# EAGLE design power (EAGLE 7.7.0)
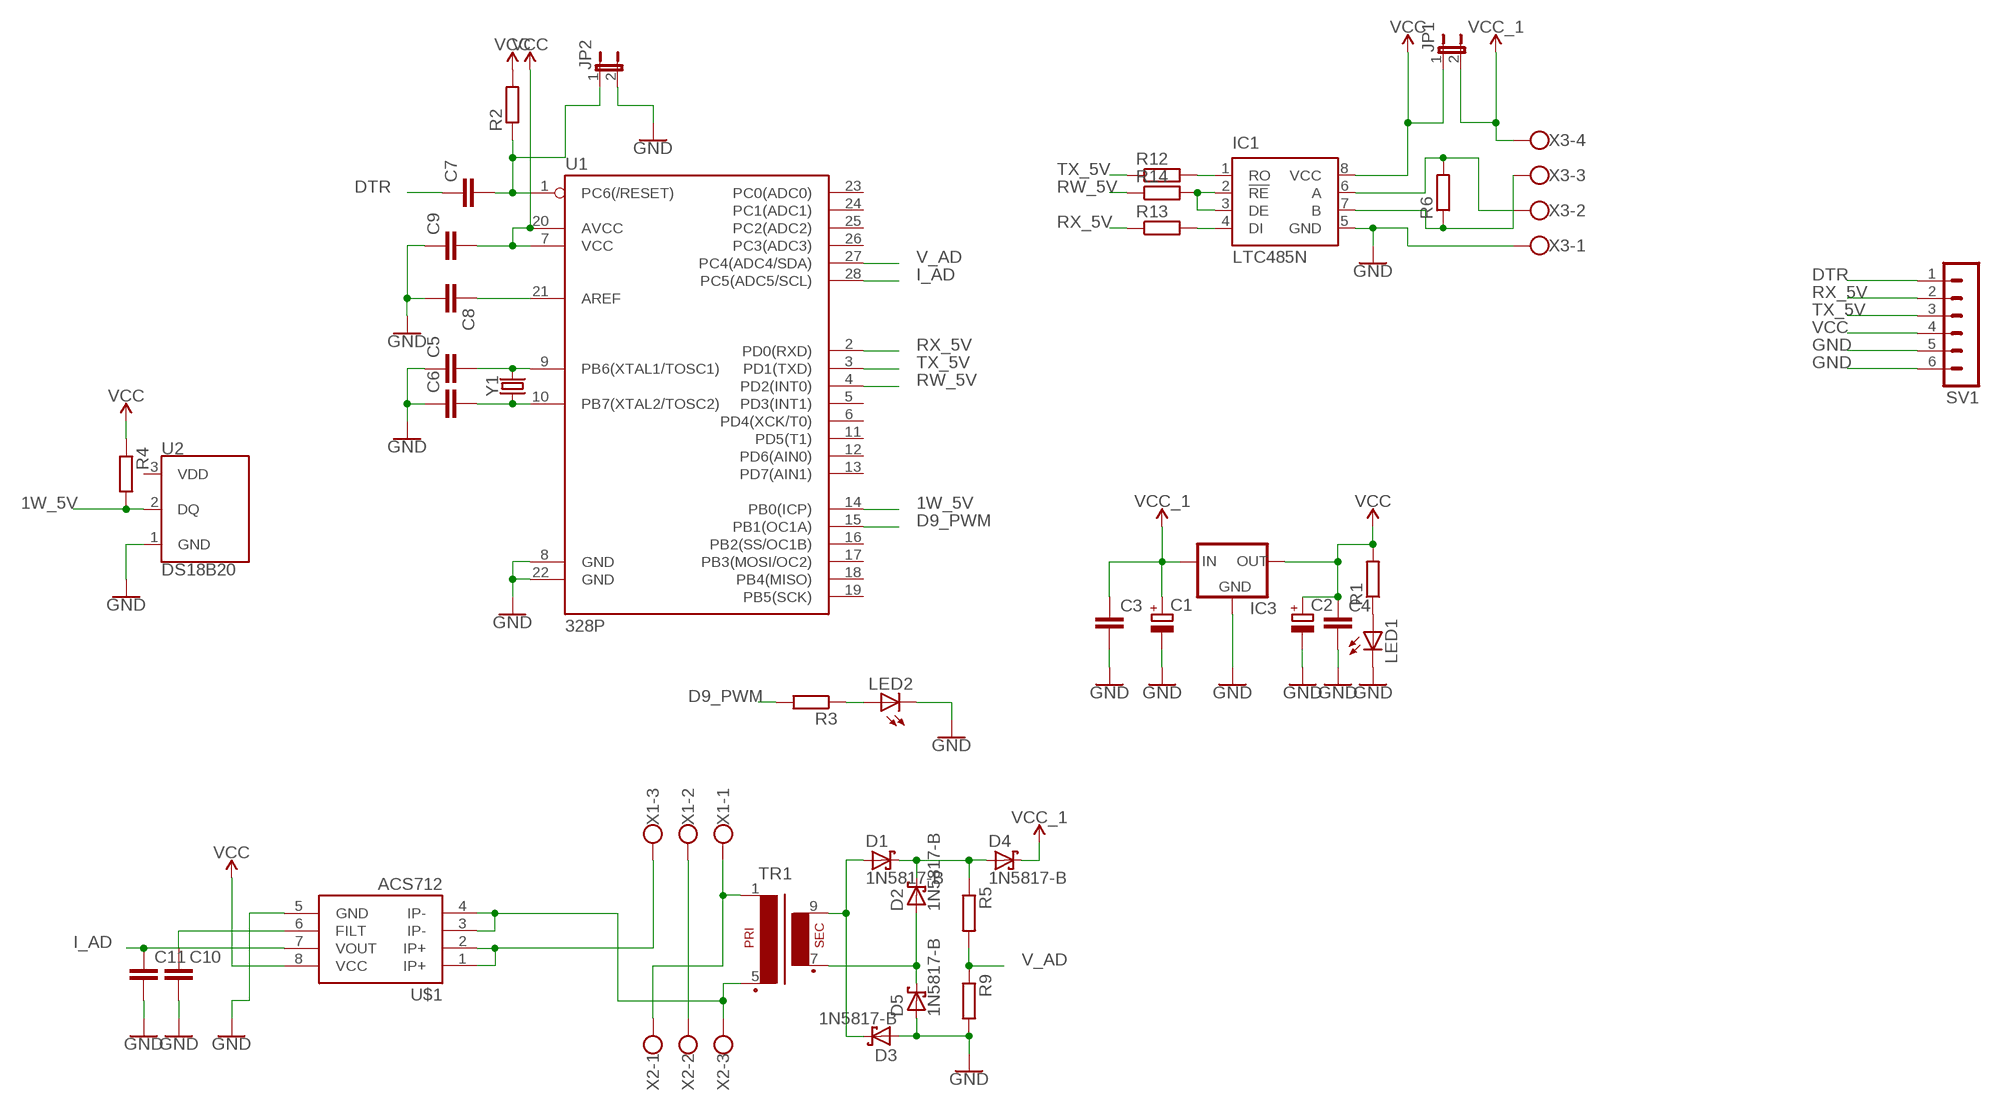
[diagram p0: schematic, sheet 1]

## Parts
C1  CPOL-EUE5-10.5  [E5-10,5]
C2  CPOL-EUE5-10.5  [E5-10,5]
C3  C-EU025-025X050  [C025-025X050]
C4  C-EU025-025X050  [C025-025X050]
C5  C-EU025-025X050  [C025-025X050]
C6  C-EU025-025X050  [C025-025X050]
C7  C-EU025-025X050  [C025-025X050]
C8  C-EU025-025X050  [C025-025X050]
C9  C-EU025-025X050  [C025-025X050]
C10  C-EU025-025X050  [C025-025X050]
C11  C-EU025-025X050  [C025-025X050]
D1  1N5817-B  [DO41-7.6]
D2  1N5817-B  [DO41-7.6]
D3  1N5817-B  [DO41-7.6]
D4  1N5817-B  [DO41-7.6]
D5  1N5817-B  [DO41-7.6]
IC1  LTC485N  [DIL08]
IC3  78XXL  [78XXL]
JP1  JP1E  [JP1]
JP2  JP1E  [JP1]
LED1  LED5MM  [LED5MM]
LED2  LED5MM  [LED5MM]
R1  R-EU_0204/7  [0204/7]
R2  R-EU_0204/7  [0204/7]
R3  R-EU_0204/7  [0204/7]
R4  R-EU_0204/7  [0204/7]
R5  R-EU_0204/7  [0204/7]
R6  R-EU_0204/7  [0204/7]
R9  R-EU_0204/7  [0204/7]
R12  R-EU_0204/7  [0204/7]
R13  R-EU_0204/7  [0204/7]
R14  R-EU_0204/7  [0204/7]
SV1  MA06-1  [MA06-1]
TR1  EI30-1  [EI30-1]
U1  328P  ATMEGA328P_PDIP  [DIP28]
U2  DS18B20  [TO-92-AMMO]
U$1  ACS712  [SO08]
X1  W237-103  [W237-103]
X2  W237-103  [W237-103]
X3  W237-4  [W237-4]
Y1  CRYSTALPTH-HC49US  [HC49US]

## Nets
1W_5V: R4.2 U1.14(PB0(ICP)) U2.2(DQ)
D9_PWM: R3.2 U1.15(PB1(OC1A))
DTR: C7.1 SV1.1
GND: C1.- C2.- C3.2 C4.2 C5.1 C6.1 C8.2 C9.1 C10.2 C11.2 D3.A D5.A IC1.5(GND) IC3.GND JP2.2 LED1.K(C) LED2.K(C) R9.2 SV1.5 SV1.6 U1.8(GND) U1.22(GND) U2.1(GND) U$1.5(GND) X3.1
I_AD: C11.1 U1.28(PC5(ADC5/SCL)) U$1.7(VOUT)
N$1: LED1.A R1.1
N$2: C5.2 U1.9(PB6(XTAL1/TOSC1)) Y1.2
N$3: C6.2 U1.10(PB7(XTAL2/TOSC2)) Y1.1
N$4: IC1.4(DI) R13.2
N$5: IC1.7(B) R6.1 X3.3
N$6: C8.1 U1.21(AREF)
N$7: LED2.A R3.1
N$8: IC1.1(RO) R12.2
N$9: D1.A D3.C TR1.9(S4)
N$10: C7.2 JP2.1 R2.1 U1.1(PC6(/RESET))
N$11: IC1.6(A) R6.2 X3.2
N$12: X1.2 X2.2
N$13: IC1.2(!RE) IC1.3(DE) R14.2
N$14: TR1.1 X1.1 X2.1
N$16: D2.A D5.C TR1.7(S3)
N$17: U$1.1(IP+) U$1.2(IP+) X1.3
N$19: C10.1 U$1.6(FILT)
N$20: TR1.5(P2) U$1.3(IP-) U$1.4(IP-) X2.3
N$26: D1.C D2.C D4.A R5.1
RW_5V: R14.1 U1.4(PD2(INT0))
RX_5V: R13.1 SV1.2 U1.2(PD0(RXD))
TX_5V: R12.1 SV1.3 U1.3(PD1(TXD))
V_AD: R5.2 R9.1 U1.27(PC4(ADC4/SDA))
VCC: C2.+ C4.1 C9.2 IC1.8(VCC) IC3.OUT JP1.1 R1.2 R2.2 R4.1 SV1.4 U1.7(VCC) U1.20(AVCC) U$1.8(VCC)
VCC_1: C1.+ C3.1 D4.C IC3.IN JP1.2 X3.4
Unconnected: U1.5(PD3(INT1)) U1.6(PD4(XCK/T0)) U1.11(PD5(T1)) U1.12(PD6(AIN0)) U1.13(PD7(AIN1)) U1.16(PB2(SS/OC1B)) U1.17(PB3(MOSI/OC2)) U1.18(PB4(MISO)) U1.19(PB5(SCK)) U1.23(PC0(ADC0)) U1.24(PC1(ADC1)) U1.25(PC2(ADC2)) U1.26(PC3(ADC3))

## Power pins joined to a net without a drawn wire
VDD: U2.3(VDD)

## Library data of the parts
C1 C2 = rcl:CPOL-EU: POLARIZED CAPACITOR, European symbol
C3-C11 = rcl:C-EU: CAPACITOR, European symbol
D1-D5 = diode:1N581*: 1.0A SCHOTTKY BARRIER RECTIFIER Source: http://www.diodes.com/datasheets/ds23001.pdf
IC1 = linear-technology:LTC485: Low Power RS485 Interface Transceiver Source: http://www.linear.com/pc/downloadDocument.do?navId=H0,C1,C1007,C1017,P2064,D1718; OC_FARNELL: unknown; OC_NEWARK: unknown
IC3 = v-reg:78XXL: VOLTAGE REGULATOR
JP1 JP2 = jumper:JP1E: JUMPER
LED1 LED2 = led:LED: LED OSRAM: - CHIPLED LG R971, LG N971, LY N971, LG Q971, LY Q971, LO R971, LY R971 LH N974, LH R974 LS Q976, LO Q976, LY Q976 LO Q996 - Hyper CHIPLED LW Q18S LB Q993, LB Q99A, LB R99A - SideLED LS A670, LO A670, LY A670, LG A670, LP A670 LB A673, LV A673, LT A673, LW A673 LH A674 LY A675 LS A676, LA A676, LO A676, LY A676, LW A676 LS A679, LY A679, LG A679 - Hyper Micro SIDELED® LS Y876, LA Y876, LO Y876, LY Y876 LT Y87S - SmartLED LW L88C, LW L88S LB L89C, LB L89S, LG L890 LS L89K, LO L89K, LY L89K LS L896, LA L896, LO L896, LY L896 - TOPLED LS T670, LO T670, LY T670, LG T670, LP T670 LSG T670, LSP T670, LSY T670, LOP T670, LYG T670 LG T671, LOG T671, LSG T671 LB T673, LV T673, LT T673, LW T673 LH T674 LS T676, LA T676, LO T676, LY T676, LB T676, LH T676, LSB T676, LW T676 LB T67C, LV T67C, LT T67C, LS T67K, LO T67K, LY T67K, LW E67C LS E67B, LA E67B, LO E67B, LY E67B, LB E67C, LV E67C, LT E67C LW T67C LS T679, LY T679, LG T679 LS T770, LO T770, LY T770, LG T770, LP T770 LB T773, LV T773, LT T773, LW T773 LH T774 LS E675, LA E675, LY E675, LS T675 LS T776, LA T776, LO T776, LY T776, LB T776 LHGB T686 LT T68C, LB T68C - Hyper Mini TOPLED® LB M676 - Mini TOPLED Santana® LG M470 LS M47K, LO M47K, LY M47K Source: http://www.osram.convergy.de LUXEON: - LUMILED® LXK2-PW12-R00, LXK2-PW12-S00, LXK2-PW14-U00, LXK2-PW14-V00 LXK2-PM12-R00, LXK2-PM12-S00, LXK2-PM14-U00 LXK2-PE12-Q00, LXK2-PE12-R00, LXK2-PE12-S00, LXK2-PE14-T00, LXK2-PE14-U00 LXK2-PB12-K00, LXK2-PB12-L00, LXK2-PB12-M00, LXK2-PB14-N00, LXK2-PB14-P00, LXK2-PB14-Q00 LXK2-PR12-L00, LXK2-PR12-M00, LXK2-PR14-Q00, LXK2-PR14-R00 LXK2-PD12-Q00, LXK2-PD12-R00, LXK2-PD12-S00 LXK2-PH12-R00, LXK2-PH12-S00 LXK2-PL12-P00, LXK2-PL12-Q00, LXK2-PL12-R00 Source: www.luxeon.com KINGBRIGHT: KA-3528ASYC Source: www.kingbright.com
R1-R6 R9 R12-R14 = rcl:R-EU_: RESISTOR, European symbol
SV1 = con-lstb:MA06-1: PIN HEADER; OC_FARNELL: unknown; OC_NEWARK: unknown
TR1 = trafo:EI30-1: TRANSFORMER 1 primary winding, 1 secondary winding ERA
U1 = SparkFun-IC-Microcontroller:ATMEGA328P_PDIP: Atmel 328P Through hole ATMEGA328P uC used in the Arduino 32kb flash, 1k EEPROM, 2k SRAM Datasheet <http://www.sparkfun.com/datasheets/Components/SMD/ATMega328.pdf> SparkFun Products Storefront component: AVR 28 Pin 20MHz 32K 6A/D - ATMega328P <https://www.sparkfun.com/products/9061> (COM-09061) SparkFun Simon Says - Through-Hole Soldering Kit <https://www.sparkfun.com/products/10547> (KIT-10547) SparkFun Learn to Solder - Simon Says <https://www.sparkfun.com/products/13708> (KIT-13708) SparkFun BigTime Watch Kit <https://www.sparkfun.com/products/11734> (KIT-11734) SparkFun ClockIt <https://www.sparkfun.com/products/10930> (KIT-10930) SparkFun Serial Enabled LCD Kit <https://www.sparkfun.com/products/10097> (LCD-10097) SparkFun Simon Tilts - Through Hole Soldering Kit <https://www.sparkfun.com/products/12634> (KIT-12634) SparkFun Frequency Counter Kit <https://www.sparkfun.com/products/10140> (KIT-10140) FabFM Radio Kit <https://www.sparkfun.com/products/11043> (KIT-11043) SparkFun Binary Blaster Kit <https://www.sparkfun.com/products/12037> (KIT-12037) SparkFun Metro-Gnome <https://www.sparkfun.com/products/9236> (KIT-09236) ATmega328 with Arduino Optiboot (Uno) <https://www.sparkfun.com/products/10524> (DEV-10524); PROD_ID: IC-09136
U2 = SparkFun-Sensors:DS18B20: Dallas/Maxim DS18B20 1-Wire Temperature Sensor The DS18B20 reports degrees C with 9 to 12-bit precision, -55C to 125C (+/-0.5C). Each sensor has a unique 64-Bit Serial number etched into it - allows for a huge number of sensors to be used on one data bus. Datasheet <http://datasheets.maximintegrated.com/en/ds/DS18B20.pdf> SparkFun Products One Wire Digital Temperature Sensor - DS18B20 <https://www.sparkfun.com/products/245> (SEN-00245); STORE_ID: SEN-00245
U$1 = SparkFun-Sensors:ACS712: ACS712 Hall-effect-based isolated linear current sensor Datasheet <http://www.sparkfun.com/datasheets/BreakoutBoards/0712.pdf> SparkFun Products SparkFun Low Current Sensor Breakout - ACS712 <https://www.sparkfun.com/products/8883> (SEN-08883); PROD_ID: IC-08964
X1 X2 = con-wago-500:W237-103: WAGO SCREW CLAMP; MPN: 237-103; OC_FARNELL: unknown; OC_NEWARK: 18M7116
X3 = con-wago-500:W237-4: WAGO SCREW CLAMP; OC_FARNELL: unknown; OC_NEWARK: unknown
Y1 = SparkFun-Clocks:CRYSTAL: Crystals (Generic) These are passive quartz crystals, which can be used as a clock source for a microcontroller. Crystal's are two-terminal devices. They require external "load" capacitors to generate an oscillating signal.

## Board
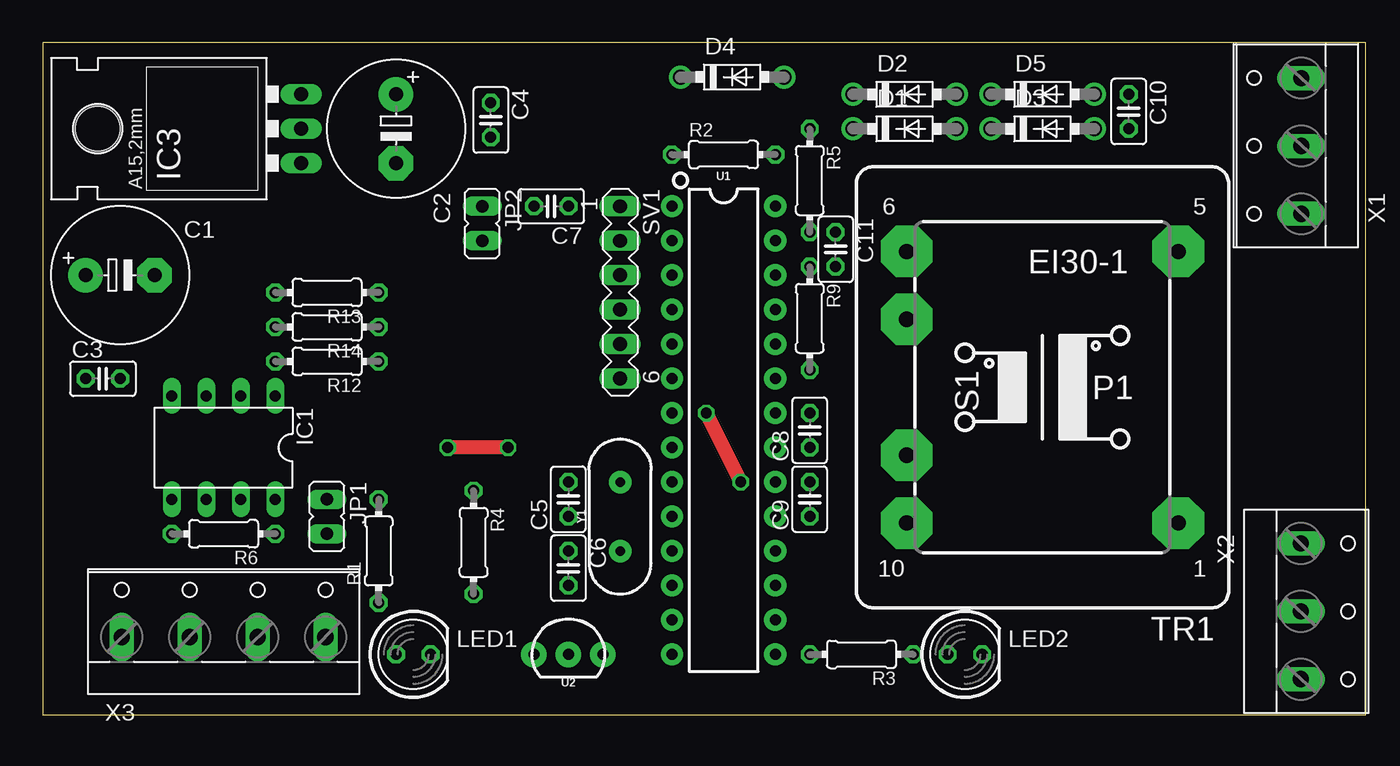
[diagram p1: board, top side]
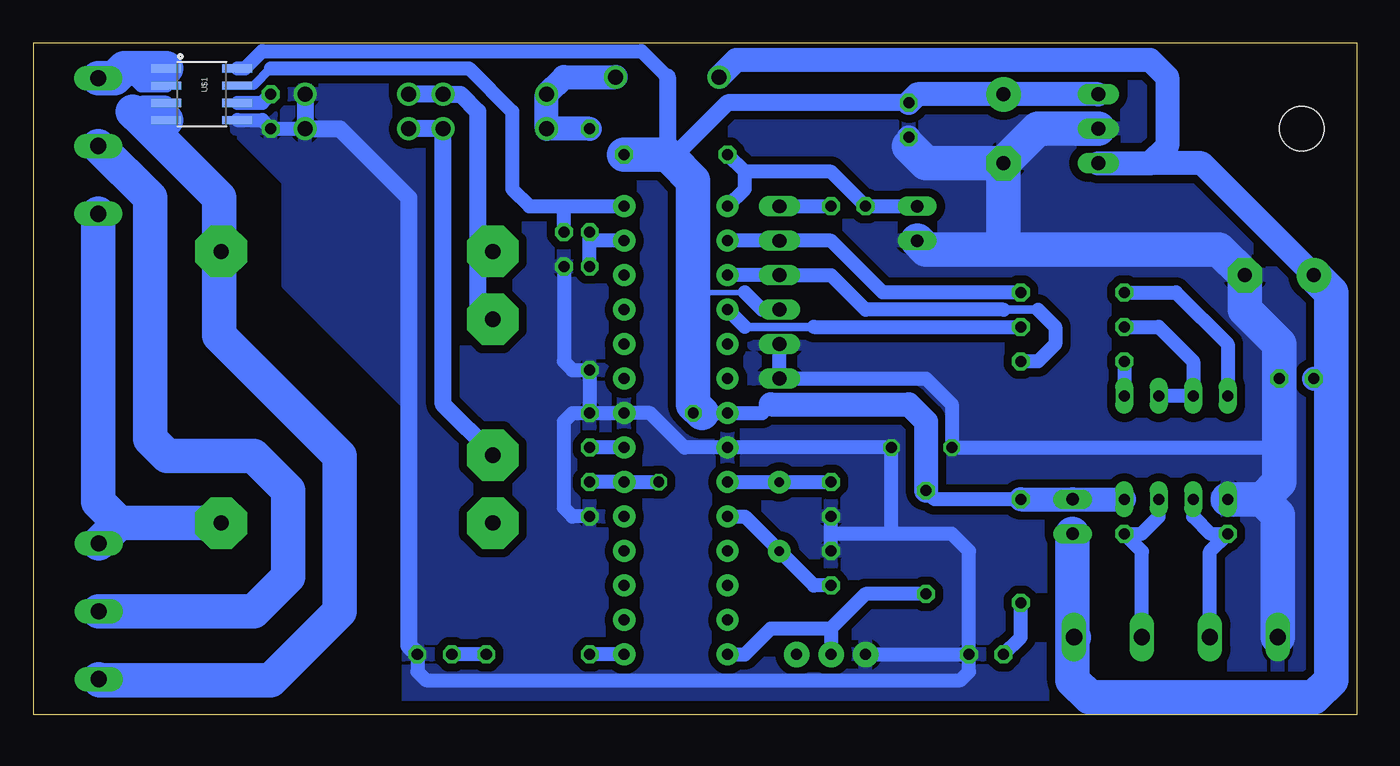
[diagram p2: board, bottom side, seen from below]

Size 97.46 x 49.52 mm. Coordinates in mm from the lower left corner, seen from the top.
Outline: 0,0 97.46,0 97.46,49.52 0,49.52 0,0
Copper layers (1*16): Top 0.035mm / dielectric 1.5mm / Bottom 0.035mm
Design rules "default": minimum track width 10mil, minimum drill 24mil, track to track 8mil, track to pad 8mil, pad to pad 8mil, via to via 8mil, smd to smd 8mil, copper to edge 40mil, drill to drill 8mil, minimum pad ring 10mil, minimum via ring 8mil, stop-mask expansion 4mil, vias tented up to drill 0mil, thermal gap 10mil

### Footprints (pad centres in the part's own frame; a part is rotated, then mirrored left to right if it is on the bottom)
E5-10,5 = drill 1.016 pad 2.54: + -2.54,0 | drill 1.016 pad 2.54 octagon: - 2.54,0
C025-025X050 = drill 0.813 octagon: 1 -1.27,0; 2 1.27,0
DO41-7.6 = drill 1.1 pad 1.7: A 3.81,0; C -3.81,0
DIL08 = drill 0.813 long: 1 -3.81,-3.81; 2 -1.27,-3.81; 3 1.27,-3.81; 4 3.81,-3.81; 5 3.81,3.81; 6 1.27,3.81; 7 -1.27,3.81; 8 -3.81,3.81
78XXL = drill 1.016 long: GND 0,-3.81; IN -2.54,-3.81; OUT 2.54,-3.81 | hole 3.302: 0,11.176
JP1 = drill 0.914 long: 1 0,-1.27; 2 0,1.27
LED5MM = drill 0.813 octagon: A -1.27,0; K 1.27,0
0204/7 = drill 0.813 octagon: 1 -3.81,0; 2 3.81,0
MA06-1 = drill 1.016 long: 1 -6.35,0; 2 -3.81,0; 3 -1.27,0; 4 1.27,0; 5 3.81,0; 6 6.35,0
EI30-1 = drill 1.118 pad 3.81 octagon: 1 -10.008,10.008; 5 -10.008,-10.008; 6 10.008,-10.008; 7 10.008,-5.004; 9 10.008,5.004; 10 10.008,10.008
DIP28 = drill 0.813 pad 1.626: 1 -16.51,-3.81; 2 -13.97,-3.81; 3 -11.43,-3.81; 4 -8.89,-3.81; 5 -6.35,-3.81; 6 -3.81,-3.81; 7 -1.27,-3.81; 8 1.27,-3.81; 9 3.81,-3.81; 10 6.35,-3.81; 11 8.89,-3.81; 12 11.43,-3.81; 13 13.97,-3.81; 14 16.51,-3.81; 15 16.51,3.81; 16 13.97,3.81; 17 11.43,3.81; 18 8.89,3.81; 19 6.35,3.81; 20 3.81,3.81; 21 1.27,3.81; 22 -1.27,3.81; 23 -3.81,3.81; 24 -6.35,3.81; 25 -8.89,3.81; 26 -11.43,3.81; 27 -13.97,3.81; 28 -16.51,3.81
TO-92-AMMO = drill 0.813 pad 1.88: 1 -2.54,0; 2 0,0; 3 2.54,0
SO08 = smd 0.61 x 2.21: 1 -1.905,-2.616; 2 -0.635,-2.616; 3 0.635,-2.616; 4 1.905,-2.616; 5 1.905,2.616; 6 0.635,2.616; 7 -0.635,2.616; 8 -1.905,2.616
W237-103 = drill 1.194 long: 1 -5,-1.29; 2 0,-1.29; 3 5,-1.29
W237-4 = drill 1.194 long: 1 -7.5,-1.27; 2 -2.5,-1.27; 3 2.5,-1.27; 4 7.5,-1.27
HC49US = drill 0.7 pad 1.651: 1 -2.54,0; 2 2.54,0

### Placement (x,y rotation side)
C1  5.71,32.38 0 top
C2  26.04,43.18 270 top
C3  4.45,24.77 0 top
C4  33.02,43.81 270 top
C5  38.73,15.88 90 top
C6  38.73,10.79 270 top
C7  37.47,37.47 180 top
C8  56.52,20.95 90 top
C9  56.52,15.88 90 top
C10  80.01,44.45 270 top
C11  58.42,34.29 270 top
D1  63.5,43.18 0 top
D2  63.5,45.72 0 top
D3  73.66,43.18 0 top
D4  50.8,46.99 0 top
D5  73.66,45.72 0 top
IC1  13.34,19.68 180 top
IC3  15.24,43.18 90 top
JP1  20.95,14.61 180 top
JP2  32.38,36.2 180 top
LED1  27.3,4.45 0 top
LED2  67.94,4.45 0 top
R1  24.77,12.06 90 top
R2  50.16,41.27 0 top
R3  60.33,4.45 180 top
R4  31.75,12.7 270 top
R5  56.52,39.37 270 top
R6  13.34,13.34 180 top
R9  56.52,29.21 270 top
R12  20.95,26.04 180 top
R13  20.95,31.11 180 top
R14  20.95,28.57 180 top
SV1  42.55,31.11 270 top
TR1  73.66,24.13 180 top
U1  50.16,20.95 270 top
U2  38.73,4.45 0 top
U$1  85.09,45.72 270 bottom
X1  91.44,41.91 90 top
X2  93.98,7.62 270 top
X3  13.34,6.99 0 top
Y1  42.55,14.61 90 top

### Tracks (layer width: path | path; a pad name or v marks a point on that pad's centre or on a via)
1W_5V
  Bottom 1.016: R4.2 36.2,8.89 38.73,6.35 | 38.73,6.35 U2.2 | U1.14 45.09,4.45 43.18,6.35 38.73,6.35
D9_PWM
  Bottom 1.016: U1.15 R3.2
DTR
  Bottom 1.016: SV1.1 C7.1
GND  (via drill 0.8)
  Top 1.016: v34.29,19.68 v29.84,19.68
  Bottom 1.016: LED1.K 28.57,12.06 29.84,13.34 34.29,13.34 | 34.29,13.34 38.73,13.34 | SV1.5 SV1.6 31.75,24.77 29.84,22.86 v29.84,19.68 5.71,19.68 | C8.2 U1.22 52.07,22.23 49.53,19.68 U1.8 v34.29,19.68 34.29,13.34 | LED2.K 69.22,3.17 68.58,2.54 29.21,2.54 28.57,3.17 LED1.K | U2.1 LED1.K | C9.1 57.78,14.61 58.42,15.24 58.42,21.59 57.78,22.23 C8.2 | U$1.5 80.64,43.81 C10.2 D3.A | C8.2 R9.2 57.78,25.4 58.42,26.04 C11.2 | C6.1 38.73,13.34 | 38.73,13.34 C5.1
  Bottom 1.27: D5.A D3.A 74.93,43.18 69.85,38.1 69.85,5.08 LED2.K
  Bottom 1.778: 33.02,41.91 C4.2
  Bottom 2.54: X3.1 5.83,14.72 6.99,15.88 | 6.99,15.88 IC1.5 | 6.99,15.88 5.71,17.14 5.71,19.68 C3.2 5.71,27.3 8.26,29.84 C1.- 10.16,34.29 25.4,34.29 | IC3.GND 23.5,43.18 C2.- | C2.- 26.04,34.92 25.4,34.29 | JP2.2 31.75,34.29 25.4,34.29 | C2.- 31.75,40.64 33.02,41.91
  pour Bottom (isolate 0.61): 0,49.53 82.55,49.53 82.55,43.18 78.74,39.37 78.74,31.75 69.85,22.86 69.85,0 0,0
I_AD
  Bottom 0.61: U$1.7 81.28,46.35 80.01,47.62
  Bottom 1.016: 80.01,47.62 65.41,47.62 62.23,44.45 62.23,38.73 60.96,37.47 58.42,37.47 | 58.42,37.47 U1.28 | C11.1 58.42,37.47
N$1
  Bottom 1.016: LED1.A 24.77,5.71 R1.1
N$2
  Bottom 1.016: U1.9 Y1.2 C5.2
N$3
  Bottom 1.016: U1.10 45.09,14.61 Y1.1 40.01,9.53 C6.2
N$4
  Bottom 1.016: R13.2 13.34,31.11 9.53,27.3 IC1.4
N$5
  Bottom 1.016: X3.3 15.84,12.03 R6.1 15.88,13.34 14.61,14.61 IC1.7
N$6
  Bottom 1.016: U1.21 C8.1
N$7
  Bottom 1.016: R3.1 LED2.A
N$8
  Bottom 1.016: R12.2 IC1.1
N$9
  Bottom 1.27: D3.C D1.A 67.31,22.86 63.65,19.2 TR1.9
N$10
  Bottom 1.016: JP2.1 C7.2 38.73,40.01 45.09,40.01 | U1.1 45.09,38.73 45.09,40.01 | 45.09,40.01 R2.1
N$11
  Bottom 1.016: IC1.6 12.06,14.61 10.79,13.34 R6.2 10.84,12.03 X3.2
N$12
  Bottom 2.54: X1.2 92.71,41.91 88.9,38.1 88.9,20.32 87.63,19.05 81.28,19.05 78.74,16.51 78.74,10.16 81.28,7.62 X2.2
N$13
  Bottom 1.016: R14.2 14.61,28.57 12.06,26.04 IC1.3 IC1.2
N$14
  Bottom 2.54: TR1.1 91.19,14.12 | 91.19,14.12 X2.1 | X1.1 92.73,15.66 91.19,14.12
N$16
  Bottom 1.27: D5.C D2.A 66.04,45.72 64.77,44.45 64.77,30.25 TR1.7 63.5,29.29
N$17
  Bottom 1.016: U$1.1 89.53,47.62 90.17,46.99 89.53,46.35 U$1.2
  Bottom 2.54: X1.3 91.52,46.91 90.81,47.62 U$1.1
N$19
  Bottom 1.016: U$1.6 80.64,45.09 C10.1
N$20
  Bottom 1.016: U$1.3 89.53,45.09 90.17,44.45
  Bottom 2.54: X2.3 92.61,2.54 80.01,2.54 74.93,7.62 74.93,19.05 83.82,27.94 83.82,33.98 TR1.5 83.82,34.29 83.82,38.1 89.53,43.81 | U$1.4 89.53,43.81 | 89.53,43.81 90.17,44.45
N$26
  Bottom 1.778: R5.1 D1.C D2.C 58.42,46.99 D4.A
RW_5V
  Bottom 0.61: 45.09,28.57 40.01,28.57
  Bottom 1.016: U1.4 45.09,28.57 | 40.01,28.57 R14.1
RX_5V
  Bottom 1.016: U1.2 SV1.2 38.73,34.92 34.92,31.11 R13.1
TX_5V
  Bottom 0.61: 23.5,29.84 26.04,29.84
  Bottom 1.016: U1.3 SV1.3 38.73,32.38 36.2,29.84 26.04,29.84 | 23.5,29.84 22.23,28.57 22.23,27.3 23.5,26.04 R12.1
V_AD
  Bottom 1.016: U1.27 56.52,34.92 R5.2 R9.1
VCC  (via drill 0.8)
  Top 1.016: v51.44,17.14 v48.9,22.23
  Bottom 0.406: 45.09,31.11 48.26,31.11 48.9,30.48
  Bottom 1.016: 43.18,22.86 43.81,22.23 U1.7 48.26,22.23 | C9.2 U1.20 v51.44,17.14 | SV1.4 43.81,29.84 45.09,31.11 | v48.9,22.23 49.53,24.13 48.9,24.13 | R1.2 31.11,15.88 R4.1 | U$1.8 81.92,47.62 80.64,48.9 52.7,48.9 50.8,46.99
  Bottom 1.27: C4.1 46.35,45.09 50.48,40.96 50.8,40.64 50.8,46.99
  Bottom 1.778: 43.18,22.86 33.02,22.86 31.75,21.59 R4.1 | R1.2 JP1.1 IC1.8 | IC3.OUT C2.+ 32.38,45.72 C4.1
  Bottom 2.54: 48.26,22.23 48.9,22.86 48.9,24.13 48.9,30.48 48.9,39.37 50.48,40.96 50.8,41.27 R2.2
VCC_1
  Bottom 1.778: C3.1 2.54,24.77 1.91,25.4 | D4.C 45.72,48.26 15.24,48.26 13.97,46.99 13.97,41.91 15.24,40.64 | IC3.IN 15.24,40.64 | C1.+ 11.43,40.64 15.24,40.64
  Bottom 2.54: JP1.2 20.95,5.83 X3.4 20.95,5.59 20.95,2.54 19.68,1.27 3.17,1.27 1.91,2.54 1.91,25.4 1.91,31.11 C1.+